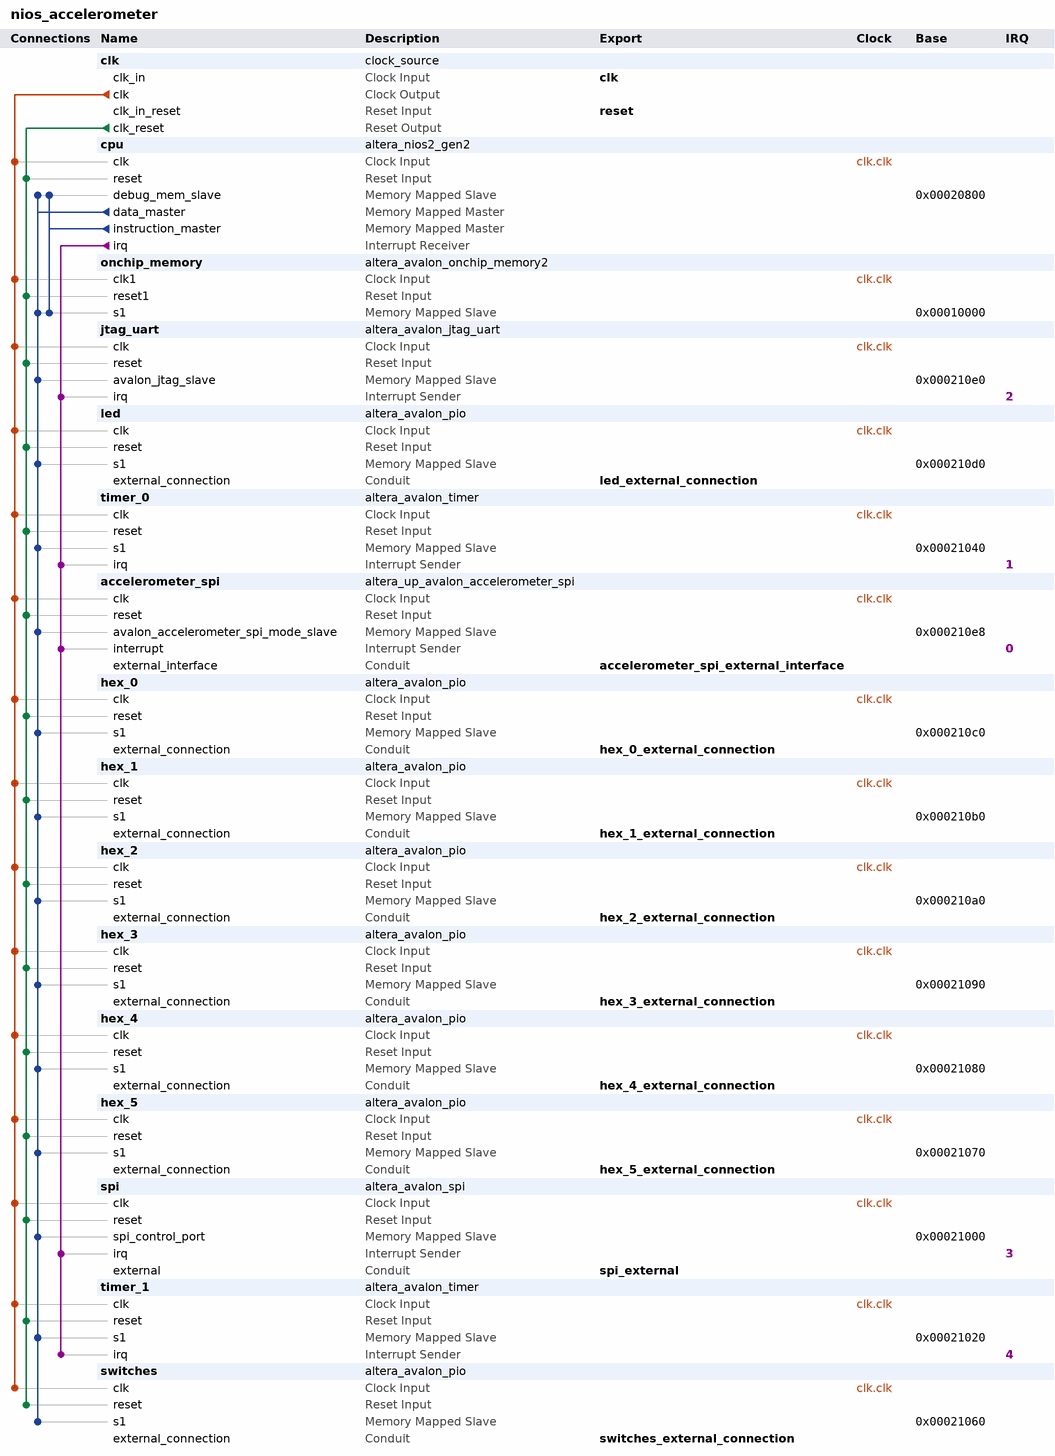
[diagram p0: system contents]
# Platform Designer (Qsys) system nios_accelerometer, MAX 10 10M50DAF484C6GES
# Parameters at their usual value, and those the tool derives, are not listed.
package require -exact qsys 20.1
create_system nios_accelerometer
set_project_property DEVICE_FAMILY {MAX 10}
set_project_property DEVICE 10M50DAF484C6GES

add_instance clk clock_source 20.1
set_instance_parameter_value clk clockFrequency 50000000

add_instance cpu altera_nios2_gen2 20.1
set_instance_parameter_value cpu dcache_size 2048
set_instance_parameter_value cpu exceptionSlave onchip_memory.s1
set_instance_parameter_value cpu icache_size 4096
set_instance_parameter_value cpu impl Tiny
set_instance_parameter_value cpu resetSlave onchip_memory.s1

add_instance onchip_memory altera_avalon_onchip_memory2 20.1
set_instance_parameter_value onchip_memory dataWidth 32
set_instance_parameter_value onchip_memory dualPort false
set_instance_parameter_value onchip_memory initMemContent true
set_instance_parameter_value onchip_memory initializationFileName /home/youlittleperson/Documents/Imperial/GoodTeam/Golden_Top/software/SPI/mem_init/nios_accelerometer_onchip_memory.hex
set_instance_parameter_value onchip_memory memorySize 65536
set_instance_parameter_value onchip_memory useNonDefaultInitFile true

add_instance jtag_uart altera_avalon_jtag_uart 20.1
set_instance_parameter_value jtag_uart simInteractiveOptions NO_INTERACTIVE_WINDOWS

add_instance led altera_avalon_pio 20.1
set_instance_parameter_value led direction Output
set_instance_parameter_value led width 10

add_instance timer_0 altera_avalon_timer 20.1
set_instance_parameter_value timer_0 period 1
set_instance_parameter_value timer_0 periodUnits MSEC

add_instance accelerometer_spi altera_up_avalon_accelerometer_spi 18.0

add_instance hex_0 altera_avalon_pio 20.1
set_instance_parameter_value hex_0 direction Output
set_instance_parameter_value hex_0 width 8

add_instance hex_1 altera_avalon_pio 20.1
set_instance_parameter_value hex_1 direction Output
set_instance_parameter_value hex_1 width 8

add_instance hex_2 altera_avalon_pio 20.1
set_instance_parameter_value hex_2 direction Output
set_instance_parameter_value hex_2 width 8

add_instance hex_3 altera_avalon_pio 20.1
set_instance_parameter_value hex_3 direction Output
set_instance_parameter_value hex_3 width 8

add_instance hex_4 altera_avalon_pio 20.1
set_instance_parameter_value hex_4 direction Output
set_instance_parameter_value hex_4 width 8

add_instance hex_5 altera_avalon_pio 20.1
set_instance_parameter_value hex_5 direction Output
set_instance_parameter_value hex_5 width 8

add_instance spi altera_avalon_spi 20.1
set_instance_parameter_value spi clockPolarity 0
set_instance_parameter_value spi dataWidth 16
set_instance_parameter_value spi masterSPI true
set_instance_parameter_value spi numberOfSlaves 1
set_instance_parameter_value spi targetClockRate 100000

add_instance timer_1 altera_avalon_timer 20.1
set_instance_parameter_value timer_1 period 1
set_instance_parameter_value timer_1 periodUnits MSEC

add_instance switches altera_avalon_pio 20.1
set_instance_parameter_value switches direction Input
set_instance_parameter_value switches width 10

# connections
add_connection clk.clk accelerometer_spi.clk clock
add_connection clk.clk cpu.clk clock
add_connection clk.clk hex_0.clk clock
add_connection clk.clk hex_1.clk clock
add_connection clk.clk hex_2.clk clock
add_connection clk.clk hex_3.clk clock
add_connection clk.clk hex_4.clk clock
add_connection clk.clk hex_5.clk clock
add_connection clk.clk jtag_uart.clk clock
add_connection clk.clk led.clk clock
add_connection clk.clk onchip_memory.clk1 clock
add_connection clk.clk spi.clk clock
add_connection clk.clk switches.clk clock
add_connection clk.clk timer_0.clk clock
add_connection clk.clk timer_1.clk clock
add_connection clk.clk_reset accelerometer_spi.reset reset
add_connection clk.clk_reset cpu.reset reset
add_connection clk.clk_reset hex_0.reset reset
add_connection clk.clk_reset hex_1.reset reset
add_connection clk.clk_reset hex_2.reset reset
add_connection clk.clk_reset hex_3.reset reset
add_connection clk.clk_reset hex_4.reset reset
add_connection clk.clk_reset hex_5.reset reset
add_connection clk.clk_reset jtag_uart.reset reset
add_connection clk.clk_reset led.reset reset
add_connection clk.clk_reset onchip_memory.reset1 reset
add_connection clk.clk_reset spi.reset reset
add_connection clk.clk_reset switches.reset reset
add_connection clk.clk_reset timer_0.reset reset
add_connection clk.clk_reset timer_1.reset reset
add_connection cpu.data_master accelerometer_spi.avalon_accelerometer_spi_mode_slave avalon
set_connection_parameter_value cpu.data_master/accelerometer_spi.avalon_accelerometer_spi_mode_slave baseAddress 0x000210e8
add_connection cpu.data_master cpu.debug_mem_slave avalon
set_connection_parameter_value cpu.data_master/cpu.debug_mem_slave baseAddress 0x00020800
add_connection cpu.data_master hex_0.s1 avalon
set_connection_parameter_value cpu.data_master/hex_0.s1 baseAddress 0x000210c0
add_connection cpu.data_master hex_1.s1 avalon
set_connection_parameter_value cpu.data_master/hex_1.s1 baseAddress 0x000210b0
add_connection cpu.data_master hex_2.s1 avalon
set_connection_parameter_value cpu.data_master/hex_2.s1 baseAddress 0x000210a0
add_connection cpu.data_master hex_3.s1 avalon
set_connection_parameter_value cpu.data_master/hex_3.s1 baseAddress 0x00021090
add_connection cpu.data_master hex_4.s1 avalon
set_connection_parameter_value cpu.data_master/hex_4.s1 baseAddress 0x00021080
add_connection cpu.data_master hex_5.s1 avalon
set_connection_parameter_value cpu.data_master/hex_5.s1 baseAddress 0x00021070
add_connection cpu.data_master jtag_uart.avalon_jtag_slave avalon
set_connection_parameter_value cpu.data_master/jtag_uart.avalon_jtag_slave baseAddress 0x000210e0
add_connection cpu.data_master led.s1 avalon
set_connection_parameter_value cpu.data_master/led.s1 baseAddress 0x000210d0
add_connection cpu.data_master onchip_memory.s1 avalon
set_connection_parameter_value cpu.data_master/onchip_memory.s1 baseAddress 0x00010000
add_connection cpu.data_master spi.spi_control_port avalon
set_connection_parameter_value cpu.data_master/spi.spi_control_port baseAddress 0x00021000
add_connection cpu.data_master switches.s1 avalon
set_connection_parameter_value cpu.data_master/switches.s1 baseAddress 0x00021060
add_connection cpu.data_master timer_0.s1 avalon
set_connection_parameter_value cpu.data_master/timer_0.s1 baseAddress 0x00021040
add_connection cpu.data_master timer_1.s1 avalon
set_connection_parameter_value cpu.data_master/timer_1.s1 baseAddress 0x00021020
add_connection cpu.instruction_master cpu.debug_mem_slave avalon
set_connection_parameter_value cpu.instruction_master/cpu.debug_mem_slave baseAddress 0x00020800
add_connection cpu.instruction_master onchip_memory.s1 avalon
set_connection_parameter_value cpu.instruction_master/onchip_memory.s1 baseAddress 0x00010000
add_connection cpu.irq accelerometer_spi.interrupt interrupt
set_connection_parameter_value cpu.irq/accelerometer_spi.interrupt irqNumber 0
add_connection cpu.irq jtag_uart.irq interrupt
set_connection_parameter_value cpu.irq/jtag_uart.irq irqNumber 2
add_connection cpu.irq spi.irq interrupt
set_connection_parameter_value cpu.irq/spi.irq irqNumber 3
add_connection cpu.irq timer_0.irq interrupt
set_connection_parameter_value cpu.irq/timer_0.irq irqNumber 1
add_connection cpu.irq timer_1.irq interrupt
set_connection_parameter_value cpu.irq/timer_1.irq irqNumber 4

# exported interfaces
add_interface accelerometer_spi_external_interface conduit end
set_interface_property accelerometer_spi_external_interface EXPORT_OF accelerometer_spi.external_interface
add_interface clk clock sink
set_interface_property clk EXPORT_OF clk.clk_in
add_interface hex_0_external_connection conduit end
set_interface_property hex_0_external_connection EXPORT_OF hex_0.external_connection
add_interface hex_1_external_connection conduit end
set_interface_property hex_1_external_connection EXPORT_OF hex_1.external_connection
add_interface hex_2_external_connection conduit end
set_interface_property hex_2_external_connection EXPORT_OF hex_2.external_connection
add_interface hex_3_external_connection conduit end
set_interface_property hex_3_external_connection EXPORT_OF hex_3.external_connection
add_interface hex_4_external_connection conduit end
set_interface_property hex_4_external_connection EXPORT_OF hex_4.external_connection
add_interface hex_5_external_connection conduit end
set_interface_property hex_5_external_connection EXPORT_OF hex_5.external_connection
add_interface led_external_connection conduit end
set_interface_property led_external_connection EXPORT_OF led.external_connection
add_interface reset reset sink
set_interface_property reset EXPORT_OF clk.clk_in_reset
add_interface spi_external conduit end
set_interface_property spi_external EXPORT_OF spi.external
add_interface switches_external_connection conduit end
set_interface_property switches_external_connection EXPORT_OF switches.external_connection

set_interconnect_requirement {$system} qsys_mm.clockCrossingAdapter HANDSHAKE
set_interconnect_requirement {$system} qsys_mm.enableEccProtection FALSE
set_interconnect_requirement {$system} qsys_mm.insertDefaultSlave FALSE
set_interconnect_requirement {$system} qsys_mm.maxAdditionalLatency 1

save_system nios_accelerometer.qsys
